# EAGLE design OMHDR (EAGLE 5.12)
VERSION: OMHDR_2_2

## Sheet 1 of 2
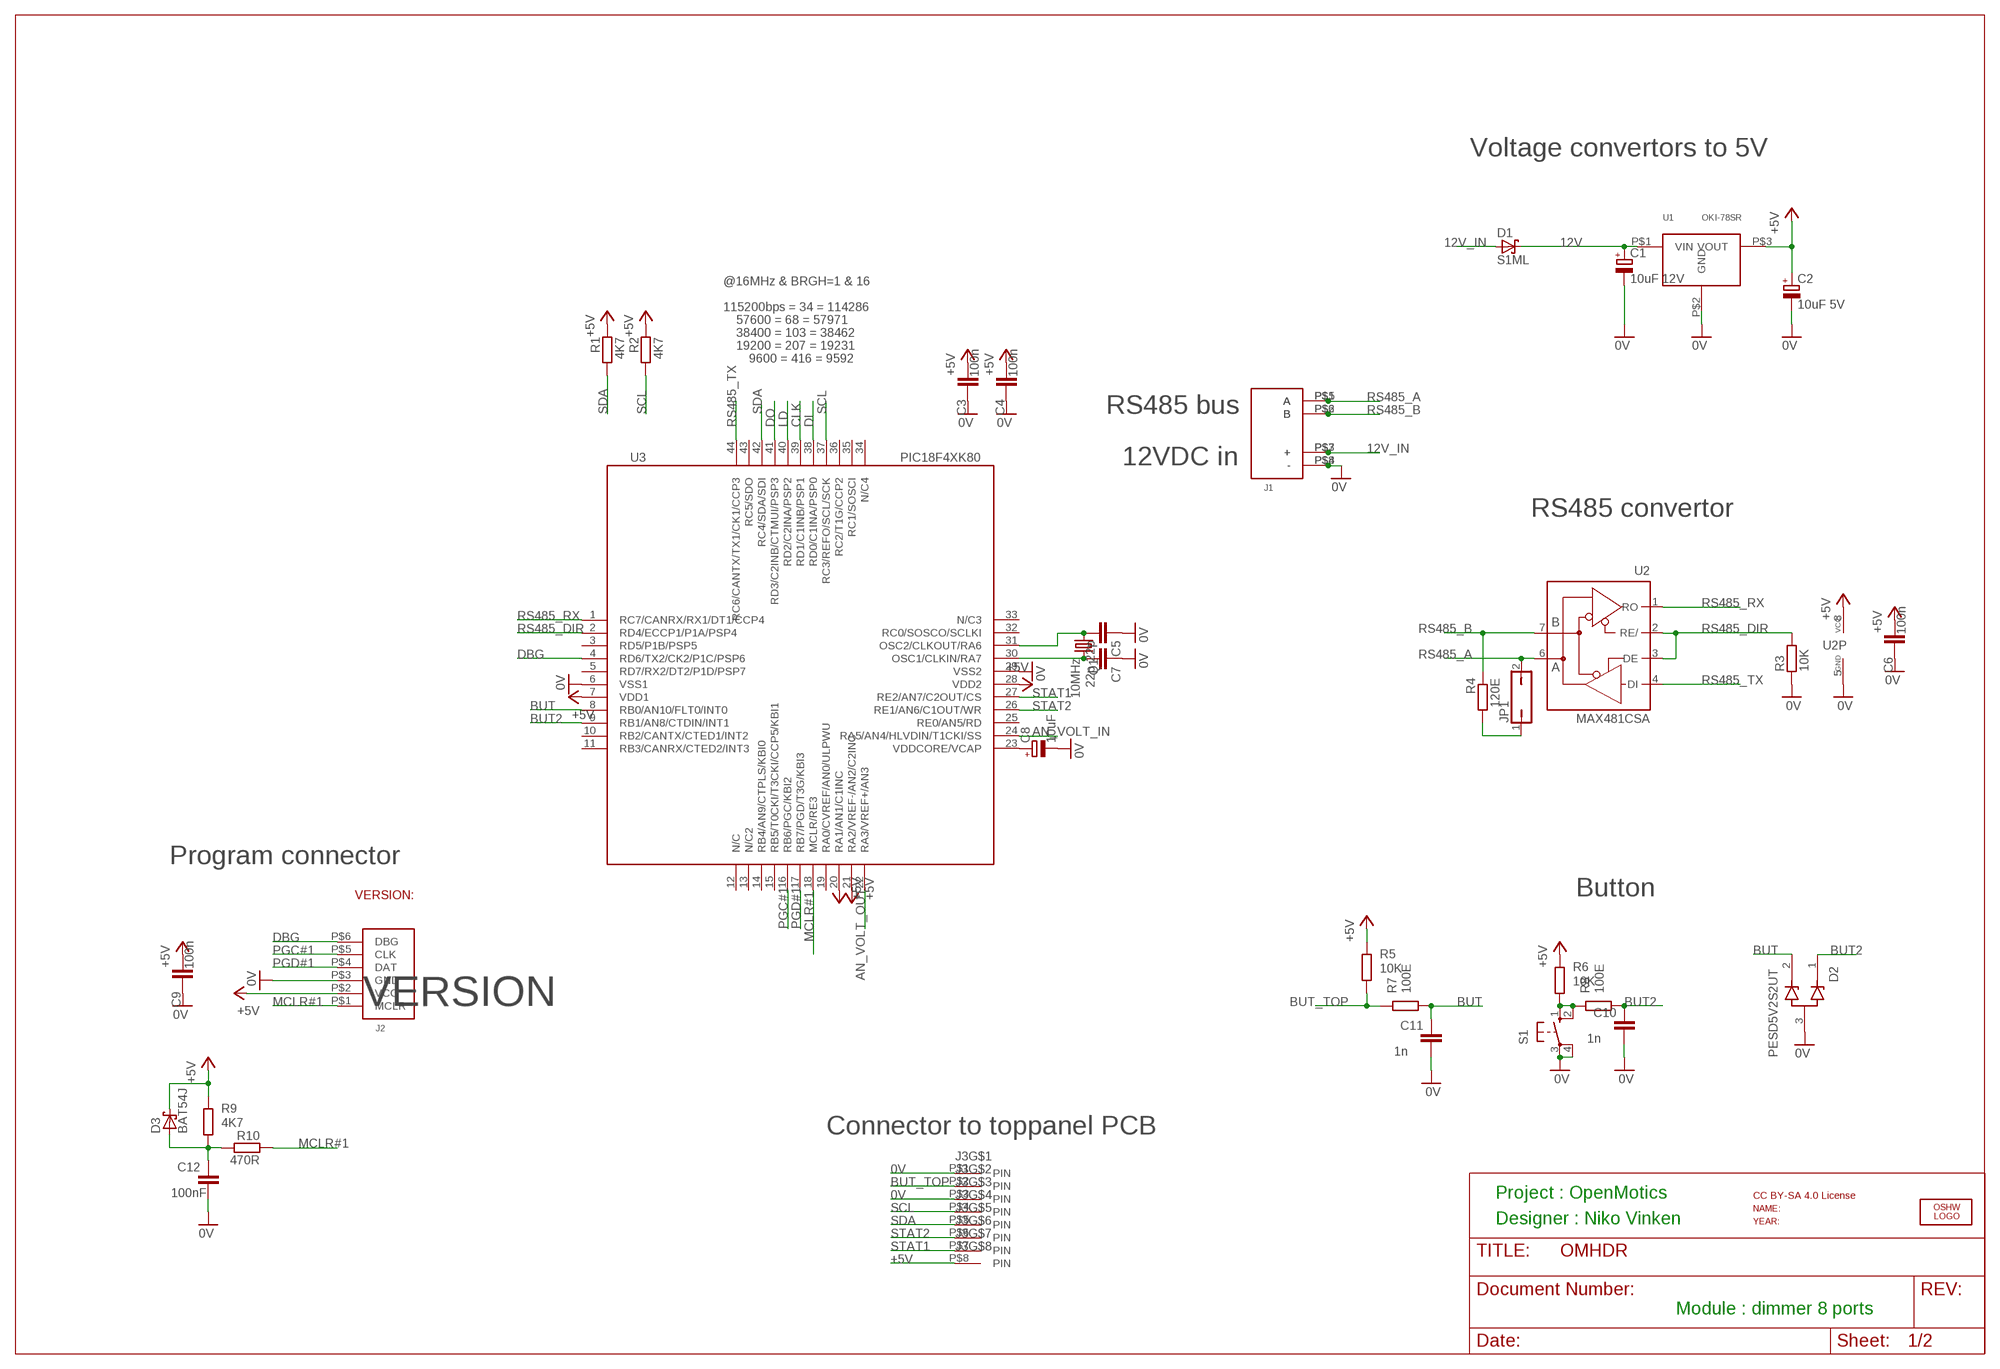
[diagram p0: schematic, sheet 1]

### Parts
C1  10uF 12V  CPOL-EUA3216-18W  [A3216-18W]
C2  10uF 5V  CPOL-EUA3216-18W  [A3216-18W]
C3  100n  C-EUC0603  [C0603]
C4  100n  C-EUC0603  [C0603]
C5  22p  C-EUC0603  [C0603]
C6  100n  C-EUC0603  [C0603]
C7  22p  C-EUC0603  [C0603]
C8  10uF  CPOL-EUA3216-18W  [A3216-18W]
C9  100n  C-EUC0603  [C0603]
C10  1n  C-EUC0603  [C0603]
C11  1n  C-EUC0603  [C0603]
C12  100nF  C-EUC0603  [C0603]
D1  S1ML  SMF5.0AT1  [SOD123FL]
D2  PESD5V2S2UT  PESD3V3S2UAT  [SOT23]
D3  BAT54J  [SOD323_REFLOW]
J1  PTDA_1.5_4-PH_5.0  [PTDA_1.5_X-PH_5.0]
J2  PROG_CON  [PROG_CON_WITH_VERSION]
J3  8PIN_CON_AMP  [8PIN_CON_AMP]
JP1  JP1Q  [JP1S]
LOGO2  OSHW_LOGO_FILLX0150-NT  [OSHW_FILLX150_NOTEXT]
Q1  10MHz  CRYSTALSM49  [SM49]
R1  4K7  R-EU_R0603  [R0603]
R2  4K7  R-EU_R0603  [R0603]
R3  10K  R-EU_R0603  [R0603]
R4  120E  R-EU_R1206  [R1206]
R5  10K  R-EU_R0603  [R0603]
R6  10K  R-EU_R0603  [R0603]
R7  100E  R-EU_R0603  [R0603]
R8  100E  R-EU_R0603  [R0603]
R9  4K7  R-EU_R0603  [R0603]
R10  470R  R-EU_R0603  [R0603]
S1  10-XX  [B3F-10XX]
U1  OKI-78SR  [OKI-78SR]
U2  MAX481CSA  [SO08]
U3  PIC18F4XK80  [TQFP44]
U$5  CC_BY_SA  [CC_BY_SA]

### Nets
0V: C1.- C2.- C3.2 C4.2 C5.1 C6.2 C7.1 C8.- C9.2 C10.1 C11.1 C12.1 D2.3 J1.P$4(-) J2.P$3(GND) J3.P$1 J3.P$3 R3.1 S1.3(P) S1.4(P1) U1.P$2(GND) U2.5(GND) U3.6(VSS1) U3.29(VSS2) ; also sheet 2
12V: C1.+ D1.C U1.P$1(VIN) ; also sheet 2
12V_IN: D1.A J1.P$3(+)
+5V: C2.+ C3.1 C4.1 C6.1 C9.1 D3.1 J2.P$2(VCC) J3.P$8 R1.1 R2.1 R5.2 R6.2 R9.2 U1.P$3(VOUT) U2.8(VCC) U3.7(VDD1) U3.20(RA1/AN1/C1INC) U3.21(RA2/VREF-/AN2/C2INC) U3.28(VDD2) ; also sheet 2
AN_VOLT_IN: U3.24(RA5/AN4/HLVDIN/T1CKI/SS) ; also sheet 2
AN_VOLT_OUT: U3.22(RA3/VREF+/AN3) ; also sheet 2
BUT: C11.2 D2.2 R7.1 U3.8(RB0/AN10/FLT0/INT0)
BUT1: R6.1 R8.2 S1.1(S) S1.2(S1)
BUT2: C10.2 D2.1 R8.1 U3.9(RB1/AN8/CTDIN/INT1)
BUT_TOP: J3.P$2 R5.1 R7.2
CLK: U3.39(RD1/C1INB/PSP1) ; also sheet 2
DBG: J2.P$6(DBG) U3.4(RD6/TX2/CK2/P1C/PSP6)
DI: U3.38(RD0/C1INA/PSP0) ; also sheet 2
DO: U3.41(RD3/C2INB/CTMUI/PSP3) ; also sheet 2
LD: U3.40(RD2/C2INA/PSP2) ; also sheet 2
MCLR#1: J2.P$1(MCLR) R10.1 U3.18(MCLR/RE3)
N$1: JP1.1 R4.2
N$9: C12.2 D3.2 R9.1 R10.2
N$32: C7.2 Q1.2 U3.30(OSC1/CLKIN/RA7)
N$33: C8.+ U3.23(VDDCORE/VCAP)
PGC#1: J2.P$5(CLK) U3.16(RB6/PGC/KBI2)
PGD#1: J2.P$4(DAT) U3.17(RB7/PGD/T3G/KBI3)
RS485_A: J1.P$1(A) JP1.2 U2.6(A)
RS485_B: J1.P$2(B) R4.1 U2.7(B)
RS485_DIR: R3.2 U2.2(RE/) U2.3(DE) U3.2(RD4/ECCP1/P1A/PSP4)
RS485_RX: U2.1(RO) U3.1(RC7/CANRX/RX1/DT1/CCP4)
RS485_TX: U2.4(DI) U3.44(RC6/CANTX/TX1/CK1/CCP3)
SCL: J3.P$4 R2.2 U3.37(RC3/REFO/SCL/SCK)
SDA: J3.P$5 R1.2 U3.42(RC4/SDA/SDI)
STAT1: J3.P$7 U3.27(RE2/AN7/C2OUT/CS)
STAT2: J3.P$6 U3.26(RE1/AN6/C1OUT/WR)
Y1: C5.2 Q1.1 U3.31(OSC2/CLKOUT/RA6)
Unconnected: J1.P$5(A) J1.P$6(B) J1.P$7(+) J1.P$8(-) U3.3(RD5/P1B/PSP5) U3.5(RD7/RX2/DT2/P1D/PSP7) U3.10(RB2/CANTX/CTED1/INT2) U3.11(RB3/CANRX/CTED2/INT3) U3.12(N/C) U3.13(N/C2) U3.14(RB4/AN9/CTPLS/KBI0) U3.15(RB5/T0CKI/T3CKI/CCP5/KBI1) U3.19(RA0/CVREF/AN0/ULPWU) U3.25(RE0/AN5/RD) U3.32(RC0/SOSCO/SCLKI) U3.33(N/C3) U3.34(N/C4) U3.35(RC1/SOSCI) U3.36(RC2/T1G/CCP2) U3.43(RC5/SDO)

### Notes on the sheet
- Voltage convertors to 5V
- @16MHz & BRGH=1 & 16
- 115200bps = 34 = 114286
- 57600 = 68 = 57971
- 38400 = 103 = 38462
- 19200 = 207 = 19231
- 9600 = 416 = 9592
- RS485 bus
- 12VDC in
- RS485 convertor
- Program connector
- Button
- Connector to toppanel PCB
- Project : OpenMotics
- Designer : Niko Vinken
- Module : dimmer 8 ports

## Sheet 2 of 2
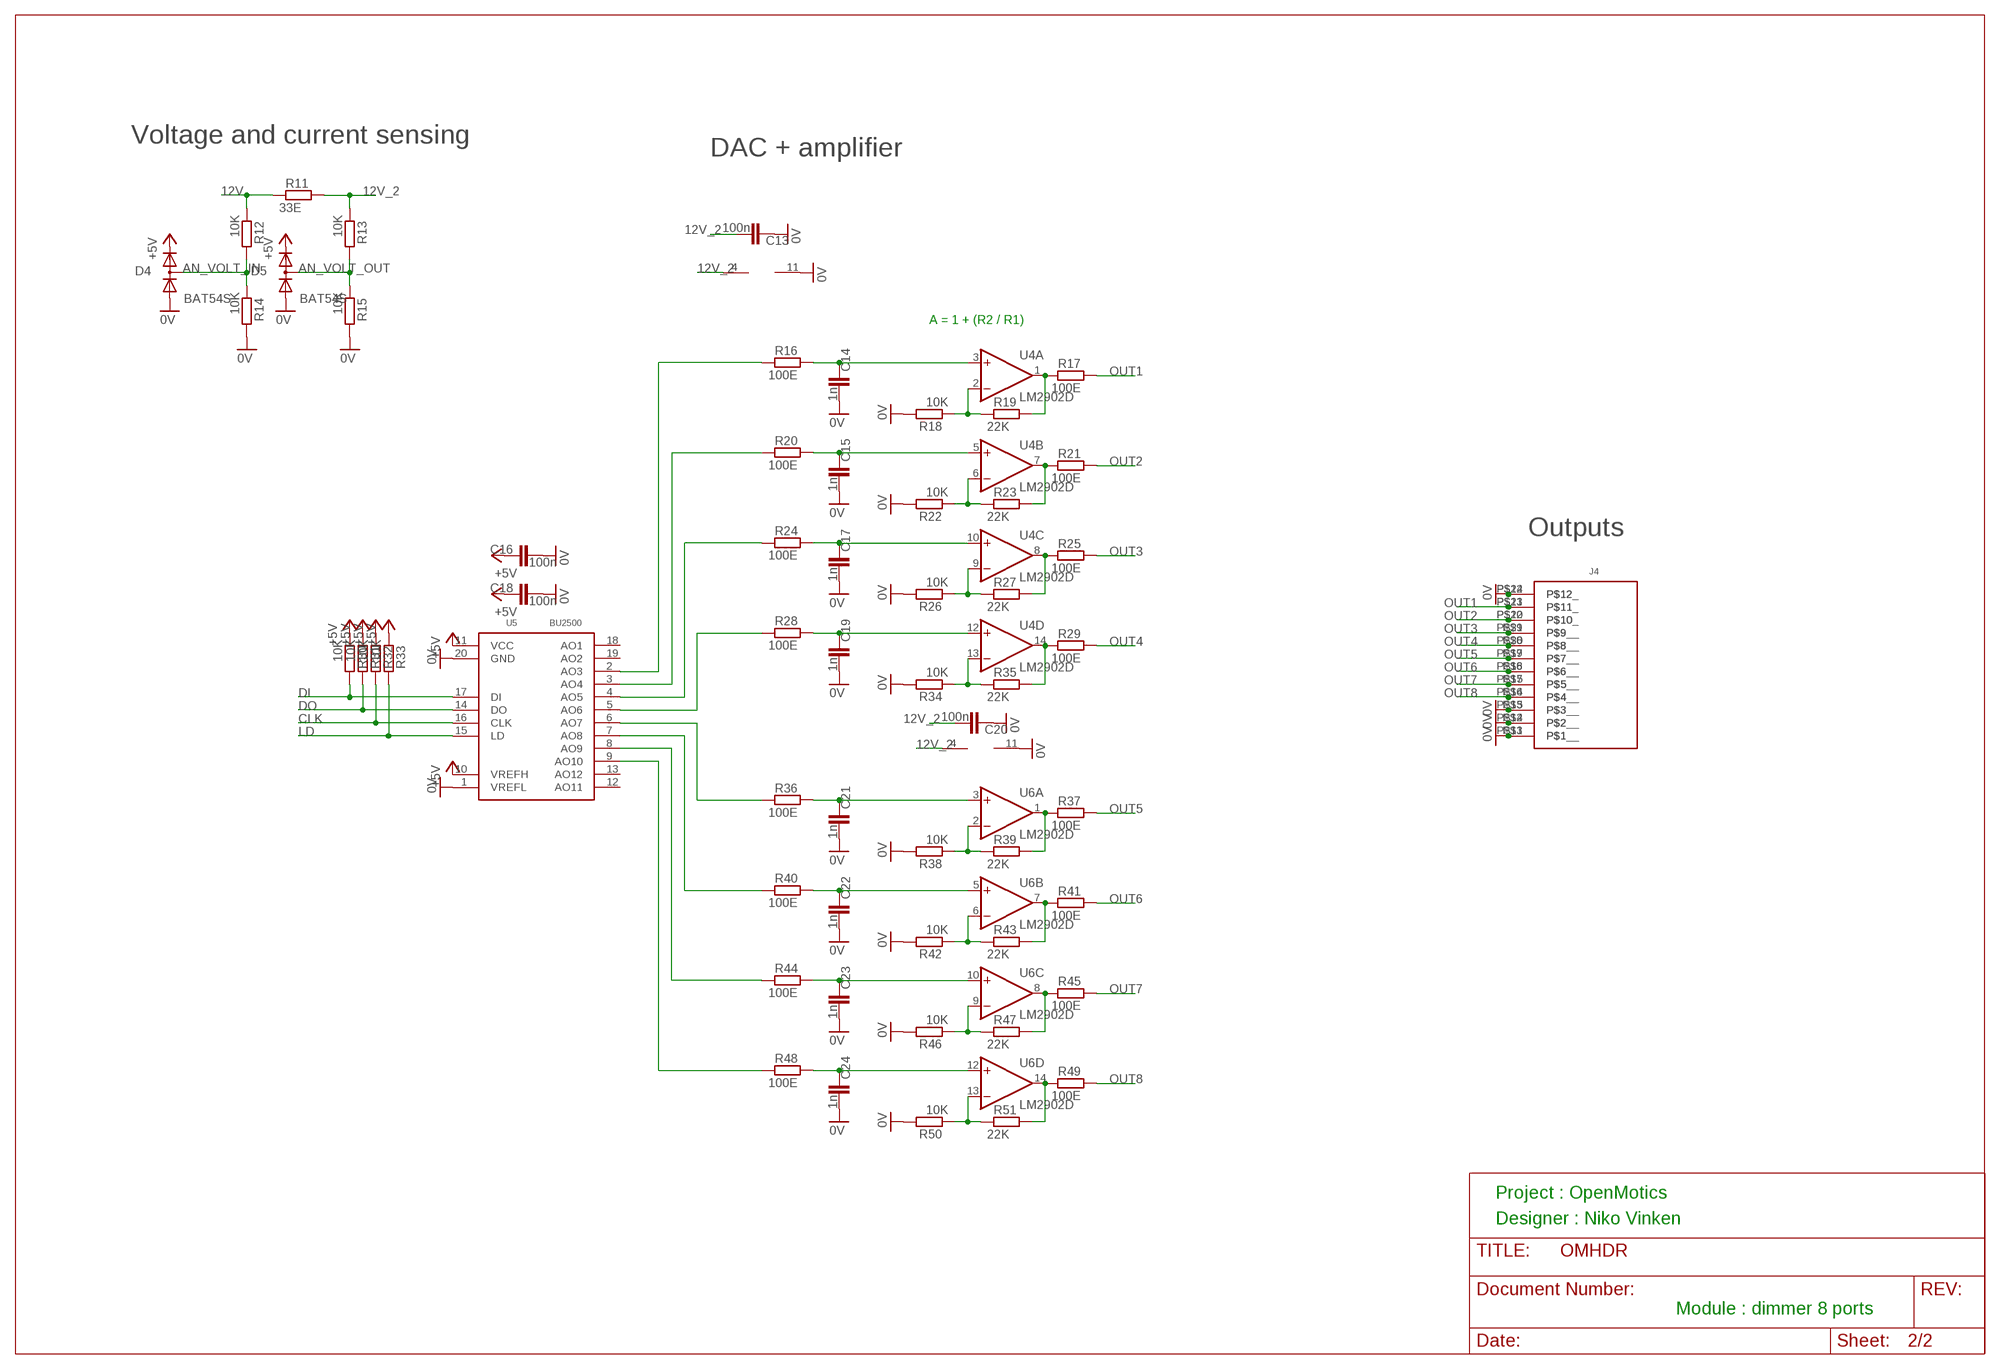
[diagram p1: schematic, sheet 2]

### Parts
C13  100n  C-EUC0603  [C0603]
C14  1n  C-EUC0603  [C0603]
C15  1n  C-EUC0603  [C0603]
C16  100n  C-EUC0603  [C0603]
C17  1n  C-EUC0603  [C0603]
C18  100n  C-EUC0603  [C0603]
C19  1n  C-EUC0603  [C0603]
C20  100n  C-EUC0603  [C0603]
C21  1n  C-EUC0603  [C0603]
C22  1n  C-EUC0603  [C0603]
C23  1n  C-EUC0603  [C0603]
C24  1n  C-EUC0603  [C0603]
D4  BAT54S  BAV199  [SOT23]
D5  BAT54S  BAV199  [SOT23]
J4  PTDA_1.5_12-PH_3.5  [PTDA_1.5_X-PH_3.5]
R11  33E  R-EU_R1206  [R1206]
R12  10K  R-EU_R0603  [R0603]
R13  10K  R-EU_R0603  [R0603]
R14  10K  R-EU_R0603  [R0603]
R15  10K  R-EU_R0603  [R0603]
R16  100E  R-EU_R0603  [R0603]
R17  100E  R-EU_R0603  [R0603]
R18  10K  R-EU_R0603  [R0603]
R19  22K  R-EU_R0603  [R0603]
R20  100E  R-EU_R0603  [R0603]
R21  100E  R-EU_R0603  [R0603]
R22  10K  R-EU_R0603  [R0603]
R23  22K  R-EU_R0603  [R0603]
R24  100E  R-EU_R0603  [R0603]
R25  100E  R-EU_R0603  [R0603]
R26  10K  R-EU_R0603  [R0603]
R27  22K  R-EU_R0603  [R0603]
R28  100E  R-EU_R0603  [R0603]
R29  100E  R-EU_R0603  [R0603]
R30  10K  R-EU_R0603  [R0603]
R31  10K  R-EU_R0603  [R0603]
R32  10K  R-EU_R0603  [R0603]
R33  10K  R-EU_R0603  [R0603]
R34  10K  R-EU_R0603  [R0603]
R35  22K  R-EU_R0603  [R0603]
R36  100E  R-EU_R0603  [R0603]
R37  100E  R-EU_R0603  [R0603]
R38  10K  R-EU_R0603  [R0603]
R39  22K  R-EU_R0603  [R0603]
R40  100E  R-EU_R0603  [R0603]
R41  100E  R-EU_R0603  [R0603]
R42  10K  R-EU_R0603  [R0603]
R43  22K  R-EU_R0603  [R0603]
R44  100E  R-EU_R0603  [R0603]
R45  100E  R-EU_R0603  [R0603]
R46  10K  R-EU_R0603  [R0603]
R47  22K  R-EU_R0603  [R0603]
R48  100E  R-EU_R0603  [R0603]
R49  100E  R-EU_R0603  [R0603]
R50  10K  R-EU_R0603  [R0603]
R51  22K  R-EU_R0603  [R0603]
U4  LM2902D  [SO14]
U5  BU2500  [SSOP20]
U6  LM2902D  [SO14]
U$4  CNMB/3  [CNMB/3-]  (not placed on a sheet)

### Nets
0V: C13.2 C14.1 C15.1 C16.1 C17.1 C18.1 C19.1 C20.2 C21.1 C22.1 C23.1 C24.1 D4.1(A) D5.1(A) J4.P$1 J4.P$2 J4.P$3 J4.P$12 J4.P$13(P$1__) J4.P$14(P$2__) J4.P$15(P$3__) J4.P$24(P$12_) R14.2 R15.2 R18.2 R22.2 R26.2 R34.2 R38.2 R42.2 R46.2 R50.2 U4.11(P:V-) U5.1(VREFL) U5.20(GND) U6.11(P:V-) ; also sheet 1
12V: R11.1 R12.1 ; also sheet 1
12V_2: C13.1 C20.1 R11.2 R13.1 U4.4(P:V+) U6.4(P:V+)
+5V: C16.2 C18.2 D4.2(C) D5.2(C) R30.1 R31.1 R32.1 R33.1 U5.10(VREFH) U5.11(VCC) ; also sheet 1
AN_VOLT_IN: D4.3(AC) R12.2 R14.1 ; also sheet 1
AN_VOLT_OUT: D5.3(AC) R13.2 R15.1 ; also sheet 1
CLK: R32.2 U5.16(CLK) ; also sheet 1
DI: R30.2 U5.17(DI) ; also sheet 1
DO: R31.2 U5.14(DO) ; also sheet 1
LD: R33.2 U5.15(LD) ; also sheet 1
N$2: R16.1 U5.2(AO3)
N$6: C14.2 R16.2 U4.3(A:+IN)
N$7: R28.1 U5.5(AO6)
N$8: R24.1 U5.4(AO5)
N$11: R38.1 R39.1 U6.2(A:-IN)
N$12: R42.1 R43.1 U6.6(B:-IN)
N$13: R46.1 R47.1 U6.9(C:-IN)
N$14: R50.1 R51.1 U6.13(D:-IN)
N$15: R37.1 R39.2 U6.1(A:OUT)
N$16: R41.1 R43.2 U6.7(B:OUT)
N$17: R45.1 R47.2 U6.8(C:OUT)
N$18: R49.1 R51.2 U6.14(D:OUT)
N$19: R36.1 U5.6(AO7)
N$20: R18.1 R19.1 U4.2(A:-IN)
N$21: R22.1 R23.1 U4.6(B:-IN)
N$22: R26.1 R27.1 U4.9(C:-IN)
N$23: R34.1 R35.1 U4.13(D:-IN)
N$24: R17.1 R19.2 U4.1(A:OUT)
N$25: R21.1 R23.2 U4.7(B:OUT)
N$26: R25.1 R27.2 U4.8(C:OUT)
N$27: R29.1 R35.2 U4.14(D:OUT)
N$28: R40.1 U5.7(AO8)
N$29: R48.1 U5.9(AO10)
N$30: C15.2 R20.2 U4.5(B:+IN)
N$31: R20.1 U5.3(AO4)
N$34: R44.1 U5.8(AO9)
N$35: C17.2 R24.2 U4.10(C:+IN)
N$36: C19.2 R28.2 U4.12(D:+IN)
N$37: C21.2 R36.2 U6.3(A:+IN)
N$38: C22.2 R40.2 U6.5(B:+IN)
N$39: C23.2 R44.2 U6.10(C:+IN)
N$40: C24.2 R48.2 U6.12(D:+IN)
OUT1: J4.P$11 J4.P$23(P$11_) R17.2
OUT2: J4.P$10 J4.P$22(P$10_) R21.2
OUT3: J4.P$9 J4.P$21(P$9__) R25.2
OUT4: J4.P$8 J4.P$20(P$8__) R29.2
OUT5: J4.P$7 J4.P$19(P$7__) R37.2
OUT6: J4.P$6 J4.P$18(P$6__) R41.2
OUT7: J4.P$5 J4.P$17(P$5__) R45.2
OUT8: J4.P$4 J4.P$16(P$4__) R49.2
Unconnected: U5.12(AO11) U5.13(AO12) U5.18(AO1) U5.19(AO2)

### Notes on the sheet
- Voltage and current sensing
- DAC + amplifier
- A = 1 + (R2 / R1)
- Outputs
- Project : OpenMotics
- Designer : Niko Vinken
- Module : dimmer 8 ports

## Library data of the parts
C1 C2 C8 = resistor:CPOL-EU: POLARIZED CAPACITOR, European symbol
C3-C7 C9-C24 = resistor:C-EU: CAPACITOR, European symbol
D1 = diode:SMF5.0AT1: 200 W Transient Voltage Suppressor Source: Data sheet <http://www.onsemi.com/pub_link/Collateral/SMF5.0AT1-D.PDF>
D2 = OpenMotics:PESD3V3S2UAT
D3 = OpenMotics:BAT54J
D4 D5 = diode:BAV199: DIODE low-leakage double diode
J1 = OpenMotics:PTDA_1.5_4-PH_5.0
J2 = OpenMotics:PROG_CON
J3 = OpenMotics:8PIN_CON_AMP
J4 = OpenMotics:PTDA_1.5_12-PH_3.5
JP1 = jumper:JP1Q: JUMPER
LOGO2 = ohw-logo:OSHW_LOGO_FILL
Q1 = crystal:CRYSTAL: CRYSTAL
R1-R10 = resistor:R-EU_: RESISTOR, European symbol
R11-R51 = rcl:R-EU_: RESISTOR, European symbol
S1 = switch-omron:10-XX: OMRON SWITCH; MPN: B3F-1000; OC_FARNELL: 176432; OC_NEWARK: 36M3542
U1 = OpenMotics:OKI-78SR
U2 = maxim:MAX481CSA: RS485 TRANSEIVER
U3 = OpenMotics:PIC18F4XK80
U4 U6 = linear:LM2902: COMPARATOR
U5 = OpenMotics:BU2500
U$4 = OpenMotics:CNMB/3
U$5 = OpenMotics:CC_BY_SA

## Board
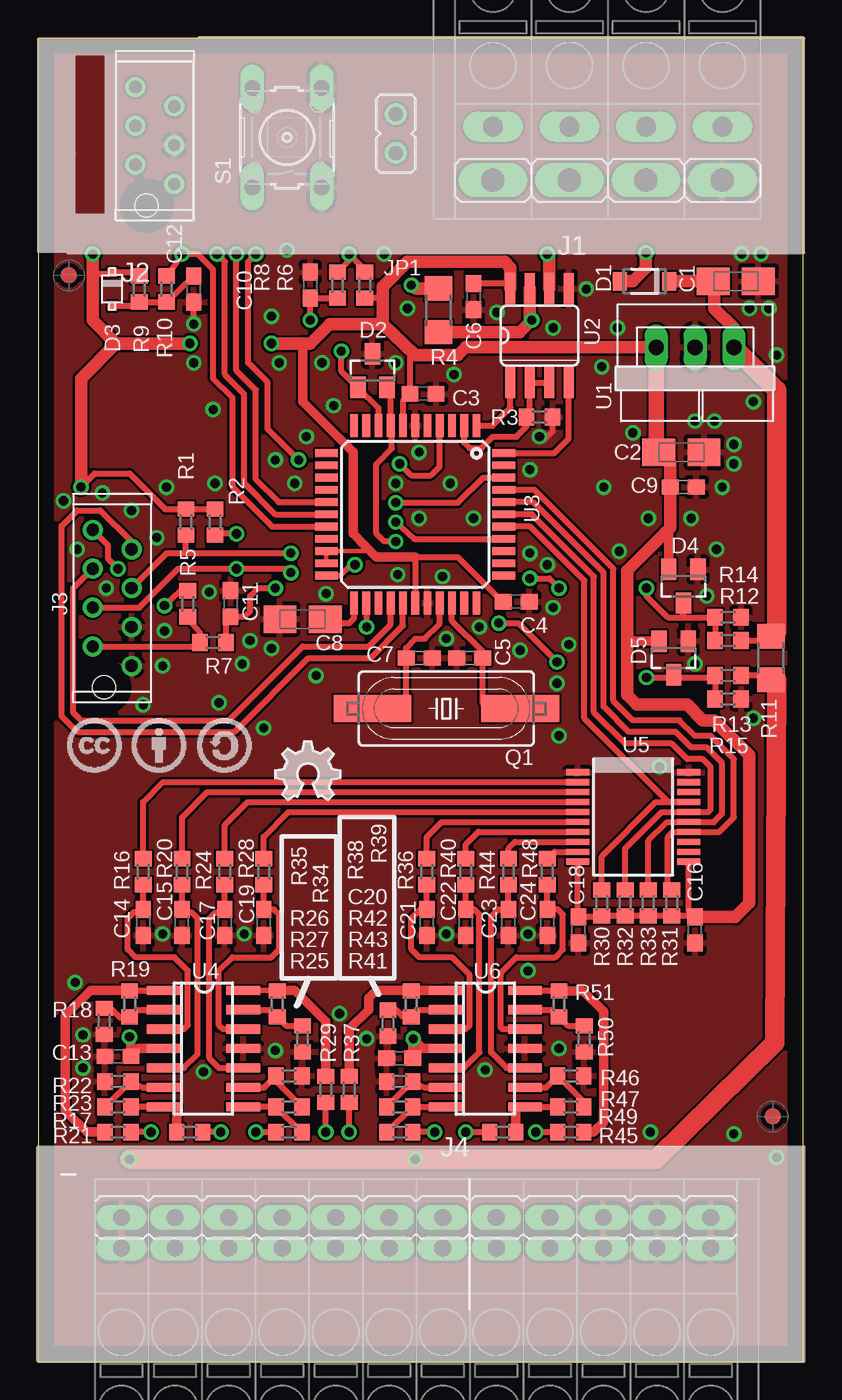
[diagram p2: board, top side]
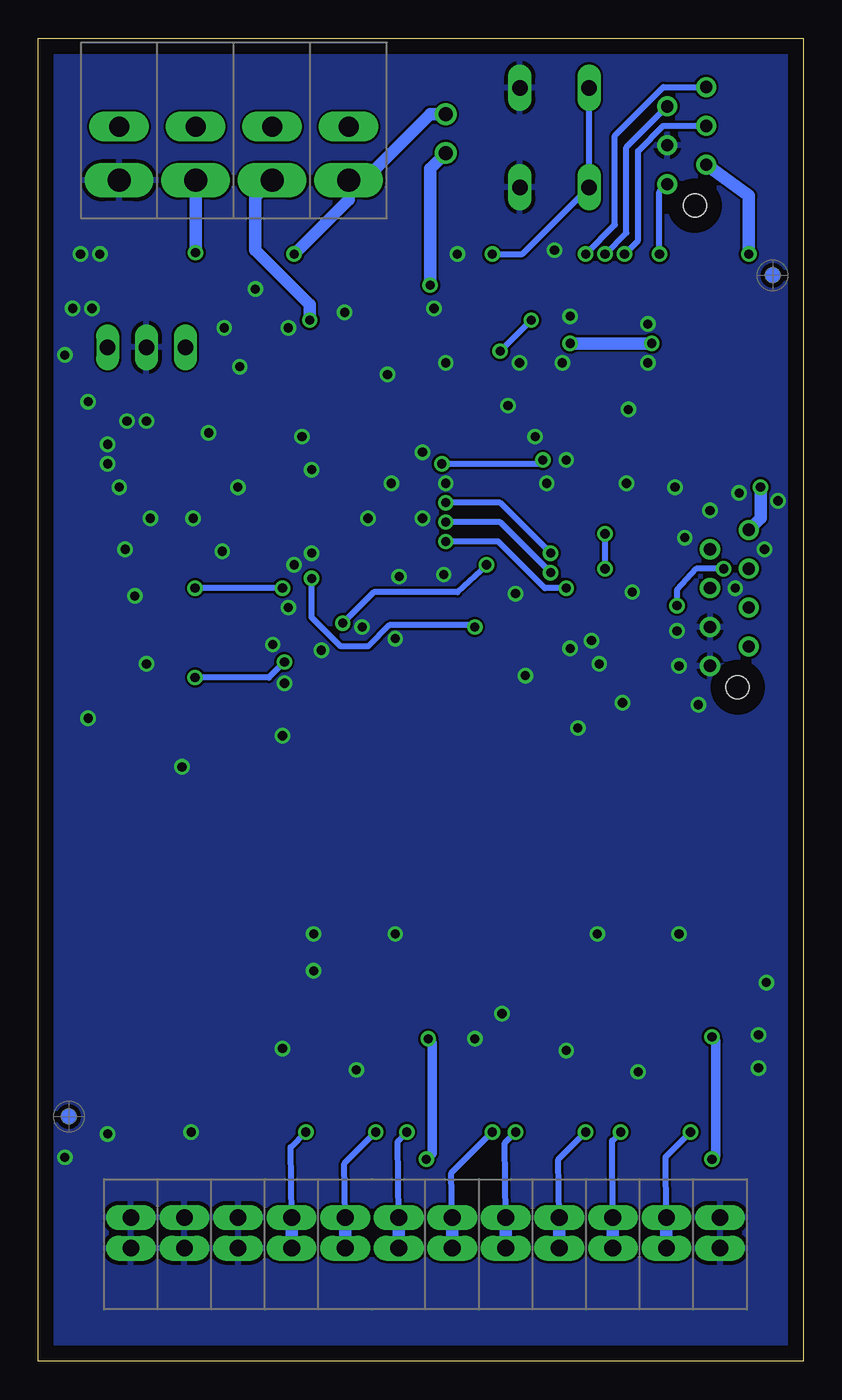
[diagram p3: board, bottom side, seen from below]

Size 50 x 86.5 mm. Coordinates in mm from the lower left corner, seen from the top.
Outline: 0,0 50,0 50,86.5 0,86.5 0,0
Copper layers (1+16): Top 0.035mm / dielectric 1.5mm / Bottom 0.035mm
Design rules "default *": minimum track width 10mil, minimum drill 24mil, track to track 6mil, track to pad 6mil, pad to pad 6mil, via to via 6mil, smd to smd 6mil, copper to edge 40mil, drill to drill 8mil, minimum pad ring 10mil, minimum via ring 8mil, stop-mask expansion 4mil, vias tented up to drill 0mil, thermal gap 10mil

### Footprints (pad centres in the part's own frame; a part is rotated, then mirrored left to right if it is on the bottom)
A3216-18W = smd 2.15 x 1.8: + 1.475,0; - -1.475,0
C0603 = smd 1.1 x 1: 1 -0.85,0; 2 0.85,0
SOD123FL = smd 0.91 x 1.22: A 1.625,0; C -1.625,0
SOT23 = smd 1 x 1.4: 1 -0.95,-1.1; 2 0.95,-1.1; 3 0,1.1
SOD323_REFLOW = smd 0.6 x 0.6: 1 1.1,0; 2 -1.1,0
PTDA_1.5_X-PH_5.0 = drill 1.5 long: P$1 0,0; P$2 5,0; P$3 10,0; P$4 15,0 | drill 1.3 long: P$5 0,3.5; P$6 5,3.5; P$7 10,3.5; P$8 15,3.5
PROG_CON_WITH_VERSION = drill 0.8 round: P$1 0,0; P$2 -2.54,1.27; P$3 0,2.54; P$4 -2.54,3.81; P$5 0,5.08; P$6 -2.54,6.35 | hole 1.5: -1.8,-1.4
8PIN_CON_AMP = drill 0.8 round: P$1 0,0; P$2 1.27,2.54; P$3 2.54,0; P$4 3.81,2.54; P$5 5.08,0; P$6 6.35,2.54; P$7 7.62,0; P$8 8.89,2.54 | hole 1.5: -1.4,1.8
PTDA_1.5_X-PH_3.5 = drill 1.1 pad 1.422 long: P$1 0,0; P$2 3.5,0; P$3 7,0; P$4 10.5,0; P$5 14,0; P$6 17.5,0; P$7 21,0; P$8 24.5,0; P$9 28,0; P$10 31.5,0; P$11 35,0; P$12 38.5,0; P$13 0,2; P$14 3.5,2; P$15 7,2; P$16 10.5,2; P$17 14,2; P$18 17.5,2; P$19 21,2; P$20 24.5,2; P$21 28,2; P$22 31.5,2; P$23 35,2; P$24 38.5,2
JP1S = drill 0.914 round: 1 1.27,1.27; 2 1.27,3.81
SM49 = smd 5.08 x 1.778: 1 -4.826,0; 2 4.826,0
R0603 = smd 1 x 1.1: 1 -0.85,0; 2 0.85,0
R1206 = smd 1.6 x 1.803: 1 -1.422,0; 2 1.422,0
B3F-10XX = drill 1.016 long: 1 -3.251,2.261; 2 3.251,2.261; 3 -3.251,-2.261; 4 3.251,-2.261
OKI-78SR = drill 1 long: P$1 0,0; P$2 2.54,0; P$3 5.08,0
SO08 = smd 0.66 x 2.032: 1 -1.905,-3.073; 2 -0.635,-3.073; 3 0.635,-3.073; 4 1.905,-3.073; 5 1.905,3.073; 6 0.635,3.073; 7 -0.635,3.073; 8 -1.905,3.073
TQFP44 = smd 1.5 x 0.5: 1 -5.8,4; 2 -5.8,3.2; 3 -5.8,2.4; 4 -5.8,1.6; 5 -5.8,0.8; 6 -5.8,0; 7 -5.8,-0.8; 8 -5.8,-1.6; 9 -5.8,-2.4; 10 -5.8,-3.2; 11 -5.8,-4; 23 5.8,-4; 24 5.8,-3.2; 25 5.8,-2.4; 26 5.8,-1.6; 27 5.8,-0.8; 28 5.8,0; 29 5.8,0.8; 30 5.8,1.6; 31 5.8,2.4; 32 5.8,3.2; 33 5.8,4 | smd 0.5 x 1.5: 12 -4,-5.8; 13 -3.2,-5.8; 14 -2.4,-5.8; 15 -1.6,-5.8; 16 -0.8,-5.8; 17 0,-5.8; 18 0.8,-5.8; 19 1.6,-5.8; 20 2.4,-5.8; 21 3.2,-5.8; 22 4,-5.8; 34 4,5.8; 35 3.2,5.8; 36 2.4,5.8; 37 1.6,5.8; 38 0.8,5.8; 39 0,5.8; 40 -0.8,5.8; 41 -1.6,5.8; 42 -2.4,5.8; 43 -3.2,5.8; 44 -4,5.8
SO14 = smd 0.6 x 2.2: 1 -3.81,-2.6; 2 -2.54,-2.6; 3 -1.27,-2.6; 4 0,-2.6; 5 1.27,-2.6; 6 2.54,-2.6; 7 3.81,-2.6; 8 3.81,2.6; 9 2.54,2.6; 10 1.27,2.6; 11 0,2.6; 12 -1.27,2.6; 13 -2.54,2.6; 14 -3.81,2.6
SSOP20 = smd 0.4 x 1.5: 1 -2.925,-3.625; 2 -2.275,-3.625; 3 -1.625,-3.625; 4 -0.975,-3.625; 5 -0.325,-3.625; 6 0.325,-3.625; 7 0.975,-3.625; 8 1.625,-3.625; 9 2.275,-3.625; 10 2.925,-3.625; 11 2.925,3.625; 12 2.275,3.625; 13 1.625,3.625; 14 0.975,3.625; 15 0.325,3.625; 16 -0.325,3.625; 17 -0.975,3.625; 18 -1.625,3.625; 19 -2.275,3.625; 20 -2.925,3.625

### Placement (x,y rotation side)
C1  45.59,70.61 180 top
C2  42.04,59.44 180 top
C3  25.15,63.25 0 top
C4  31.24,49.66 0 top
C5  28.19,45.97 0 top
C6  28.45,69.6 270 top
C7  24.89,45.97 180 top
C8  17.27,48.51 0 top
C9  42.16,57.15 0 top
C10  17.78,70.36 270 top
C11  12.57,49.53 270 top
C12  10.16,70.1 90 top
C13  5.21,19.94 180 top
C14  6.86,28.7 90 top
C15  9.4,28.7 90 top
C16  42.93,28.19 90 top
C17  12.19,28.7 90 top
C18  35.31,28.19 90 top
C19  14.73,28.7 90 top
C20  23.62,19.81 180 top
C21  25.4,28.7 90 top
C22  27.94,28.7 90 top
C23  30.73,28.7 90 top
C24  33.27,28.7 90 top
D1  39.62,70.61 180 top
D2  21.84,64.77 0 top
D3  4.83,70.1 90 top
D4  42.16,50.67 180 top
D5  41.53,45.97 180 top
J1  29.72,77.22 0 top
J2  8.89,76.96 0 top
J3  6.1,45.47 90 top
J4  43.94,9.4 180 top
JP1  22.1,77.72 0 top
LOGO2  15.49,36.7 0 top
Q1  26.67,42.67 180 top
R1  9.65,54.86 270 top
R2  11.56,54.86 270 top
R3  32.77,61.72 180 top
R4  26.16,68.71 90 top
R5  9.78,49.53 90 top
R6  21.34,70.36 270 top
R7  11.43,46.99 180 top
R8  19.56,70.36 90 top
R9  6.6,70.1 90 top
R10  8.38,70.1 270 top
R11  47.88,45.97 270 top
R12  45.09,47.12 180 top
R13  45.09,44.83 180 top
R14  45.09,48.64 0 top
R15  45.09,43.31 0 top
R16  6.86,32 270 top
R17  5.21,14.99 0 top
R18  4.32,22.23 270 top
R19  5.97,23.37 90 top
R20  9.4,32 270 top
R21  9.91,14.99 0 top
R22  5.21,18.29 180 top
R23  5.21,16.64 0 top
R24  12.19,32 270 top
R25  16.38,14.99 180 top
R26  16.38,18.67 0 top
R27  16.38,16.64 180 top
R28  14.73,32 270 top
R29  18.8,17.78 270 top
R30  36.83,29.97 90 top
R31  41.4,29.97 90 top
R32  38.35,29.97 90 top
R33  39.88,29.97 90 top
R34  17.27,21.08 270 top
R35  15.62,23.37 90 top
R36  25.4,32 270 top
R37  20.32,17.78 270 top
R38  22.86,22.1 270 top
R39  24.38,23.37 90 top
R40  27.94,32 270 top
R41  23.62,14.99 0 top
R42  23.62,18.29 180 top
R43  23.62,16.64 0 top
R44  30.73,32 270 top
R45  30.35,14.99 180 top
R46  34.8,18.67 0 top
R47  34.8,16.64 180 top
R48  33.27,32 270 top
R49  34.8,14.99 180 top
R50  35.69,21.08 270 top
R51  34.04,23.37 90 top
S1  16.26,80.01 90 top
U1  45.47,66.29 180 top
U2  32.77,67.06 0 top
U3  24.64,55.37 270 top
U4  10.79,20.45 270 top
U5  38.88,35.59 270 top
U6  29.21,20.45 270 top
U$1  [FIDUCIAL_G10]  48,16 0 bottom
U$2  [FIDUCIAL_G10]  2,71 0 top
U$3  [FIDUCIAL_G10]  48,16 0 top
U$4  -1.52,-1.78 0 top
U$5  7.87,40.26 0 top
U$12  [FIDUCIAL_G10]  2,71 0 bottom

### Tracks (layer width: path | path; a pad name or v marks a point on that pad's centre or on a via)
0V  (via drill 0.6)
  Top 0.406: R3.1 33.62,60.79 33.02,60.2 | v10.16,67.82 C12.1
  other vias: 16.26,72.64 24.13,68.83 29.97,68.58 35.81,70.1 45.47,59.94 44.2,61.47 42.93,61.47 45.47,58.67 44.7,57.15 24.89,59.44 26.42,51.31 26.67,47.24 13.84,47.12 15.24,46.61 26.92,57.4 24.89,55.12 28.45,55.12 27.18,64.52 23.37,65.28 15.75,65.28 16.76,57.4 8.38,57.15 6.1,55.63 4.45,50.55 8.26,47.75 8.13,45.47 17.53,60.45 6.86,42.93 32.77,60.45 18.54,65.28 19.3,62.48 22.61,72.39 47.24,72.39 23.37,57.4 2.92,21.34 2.92,19.18 15.49,20.32 34.04,20.45 48.26,13.34 45.47,14.86 40.01,14.99 29.21,19.05 10.79,18.92 2.41,24.77 32,25.53 19.68,22.73 40.61,38.86 34.04,40.89 32.13,58.29 32.13,52.83 33.66,49.28 44.32,53.09 42.93,45.59 46.74,42.04 43.69,50.04 33.91,44.32 34.67,46.86 33.27,52.07 37.97,52.96 36.96,57.15 38.86,60.71 33.66,67.56 21.46,21.08 28.83,48.01 31.5,46.48 11.18,50.29 2.54,53.09 4.19,56.77 7.75,53.85 13.34,45.59 11.81,43.05 18.16,44.83 14.73,41.4 23.5,51.44 18.81,50.19 1.65,56.26 15.24,68.33 10.16,65.28 15.49,58.93 11.43,62.23 11.56,57.4 8.13,27.94 13.46,27.94 32,27.94 26.67,27.94 45.97,72.39 46.48,68.83 47.75,68.83 48.26,65.79 46.74,62.74 36.83,65.02 37.85,67.56 42.67,55.12 39.88,55.12
  pour Bottom: 0.25,86.36 49.78,86.36 49.78,0.25 0.25,0.25
  pour Top: 0.25,86.36 49.78,86.36 49.78,0.25 0.25,0.25
12V
  Top 0.406: R12.1 47.6,47.12 R11.1
  Top 0.813: D1.C C1.+ 44.2,70.53 44.2,68.83 45.47,67.56 U1.P$1
  Top 1.27: R11.1 arc90 48.26,47.78 48.26,63.5 U1.P$1
12V_2  (via drill 0.6)
  Top 0.406: R13.1 47.6,44.83 R11.2
  Top 0.61: U4.4 6.57,20.45 C13.1 6.06,21.12 v5.97,21.21 | U6.4 25.15,20.45 v24.51,21.08 24.47,21.04 C20.1
  Top 1.27: R11.2 48.26,44.55 48.13,20.83 40.39,13.21 v24.64,13.21 v5.97,13.21
  Bottom 0.61: v24.51,21.08 24.26,20.83 24.26,13.59 v24.64,13.21 | v5.97,13.21 5.71,13.46 5.71,20.95 v5.97,21.21
12V_IN  (via drill 0.6)
  Top 0.813: v39.72,72.48 39.72,71.47 38.86,70.61 D1.A
  Bottom 0.813: v39.72,72.48 J1.P$3
+5V  (via drill 0.6)
  Top 0.305: U3.21 U3.20 21.34,52.97 21.34,53.34
  Top 0.406: C6.1 30.54,70.45 U2.8 | R6.2 22.18,69.51 22.52,69.85 | C4.1 30.14,49.87 27.43,52.58 24.64,52.58 U3.28 | U3.7 23.84,62.79 C3.1 24.3,65.62 24.64,65.79 | J3.P$8 4.57,53.34 4.57,52.45 v5.21,51.82 | v8.26,49.4 9.31,50.38 R5.2 | R9.2 6.35,71.2 D3.1 4.74,71.12 3.56,71.12 | U5.10 35.26,29.09 C18.2 36.75,29.04 R30.1 R32.1 R33.1 R31.1 42.85,29.12 C16.2 42.51,29.46 U5.11 | R2.1 R1.1 8.29,55.71 5.97,58.04 3.68,58.04 v2.79,57.15
  Top 0.61: 24.64,52.58 22.1,52.58 21.34,53.34 20.57,54.1 20.57,59.44 17.27,62.74 17.27,66.55 | D4.2 41.21,54.04 41.02,54.23 | D5.2 38.65,47.07 38.48,47.24
  Top 0.813: U2.8 30.86,71.5 30.48,71.88 24.13,71.88 22.52,70.27 22.52,69.85 22.52,67.82 | 22.52,67.82 19.05,67.82 17.78,66.55 17.27,66.55 v15.24,66.55 | 22.52,67.82 24.64,65.79 27.43,65.79 27.94,66.29 U1.P$3 | v3.56,72.39 3.56,71.12 3.56,68.07 5.08,66.55 | 5.08,66.55 v9.91,66.55 | 5.08,66.55 2.79,64.26 v2.79,57.15 | C16.2 45.55,29.04 46.48,29.97 46.48,39.62 44.2,41.91 43.43,41.91 42.42,42.93 39.12,42.93 38.48,43.56 38.48,47.24 38.48,51.69 41.02,54.23 41.31,54.52 C9.1 41.31,58.68 C2.+
  Top 1.016: U1.P$3 40.39,59.44 C2.+
  Bottom 0.406: v5.21,51.82 6.99,51.82 8.26,50.42 v8.26,49.4
  Bottom 0.813: J2.P$2 3.56,76.2 v3.56,72.39 | v9.91,66.55 v15.24,66.55 | v2.79,57.15 2.79,55.12 J3.P$8
AN_VOLT_IN  (via drill 0.6)
  Top 0.406: v32.13,51.18 33.4,51.18 v34.04,50.55 | v39.75,50.55 39.75,50.04 41.15,48.64 42.29,48.64 | 42.29,48.64 R14.1 | R14.1 R12.2 | R14.1 44.15,48.72 | D4.3 42.16,48.77 42.29,48.64 | U3.24 21.46,49.55 v21.46,48.01
  Bottom 0.406: v34.04,50.55 v39.75,50.55 | v21.46,48.01 21.59,48.13 27.05,48.13 28.45,46.74 30.23,46.74 32.13,48.64 v32.13,51.18
AN_VOLT_OUT  (via drill 0.6)
  Top 0.406: v30.1,48.26 31.37,48.26 v33.91,45.72 | v39.75,44.7 41.15,44.7 | 41.15,44.7 44.11,44.7 R13.2 R15.1 | D5.3 41.32,44.87 41.15,44.7 | v20.7,52.07 20.45,52.07 19.75,51.37 U3.22
  Bottom 0.406: v20.7,52.07 22.61,50.29 28.07,50.29 v30.1,48.26 | v33.91,45.72 34.92,44.7 v39.75,44.7
BUT  (via drill 0.6)
  Top 0.406: v23.37,53.59 22.61,53.59 22.1,54.1 22.1,58.67 23.11,59.69 23.11,61.1 U3.8 23.04,63.43 D2.2 | R7.1 12.28,48.39 C11.2 13.5,48.68 13.84,49.02 13.84,50.04 14.35,50.55 v15.49,50.55
  Bottom 0.406: v15.49,50.55 16.89,50.55 19.94,53.59 v23.37,53.59
BUT1  (via drill 0.6)
  Top 0.406: R6.1 21.34,71.37 v20.32,72.39 20.32,71.97 R8.2
  Bottom 0.406: S1.2 S1.1 18.36,72.39 v20.32,72.39
BUT2  (via drill 0.6)
  Top 0.406: R8.1 C10.2 17.78,68.33 arc90 v17.78,68.07 | U3.9 22.24,62.33 D2.1 19.81,64.75 v19.81,66.04
  Bottom 0.406: v19.81,66.04 v17.78,68.07
BUT_TOP
  Top 0.406: R5.1 9.78,48.51 10.58,47.62 R7.2 10.33,46.74 J3.P$2
CLK
  Top 0.406: U3.39 32.26,55.37 36.32,51.31 36.32,42.42 38.35,40.39 41.4,40.39 42.42,39.37 43.43,39.37 43.94,38.86 43.94,36.07 43.78,35.91 U5.16 40.74,35.91 38.35,33.53 R32.2
DBG  (via drill 0.6)
  Top 0.406: U3.4 26.24,58.5 25.65,57.91 24.38,57.91 v23.62,58.67 | v17.02,58.93 14.99,60.96 14.99,64.01 13.72,65.28 13.72,71.88 v14.22,72.39
  Bottom 0.406: J2.P$6 9.14,83.31 12.32,80.14 12.32,74.3 v14.22,72.39 | v23.62,58.67 17.27,58.67 v17.02,58.93
DI
  Top 0.406: U3.38 32.17,54.57 35.69,51.05 35.69,42.04 41.16,36.56 U5.17 40.37,36.56 36.83,33.02 R30.2
DO
  Top 0.406: U3.41 32.44,56.97 37.59,51.82 37.59,43.18 38.86,41.91 41.91,41.91 42.93,40.89 43.94,40.89 45.47,39.37 45.47,35.56 44.52,34.61 U5.14 41.47,34.61 41.15,34.29 41.15,31.24 R31.2
LD
  Top 0.406: U3.40 32.35,56.17 36.96,51.56 36.96,42.8 38.61,41.15 41.66,41.15 42.67,40.13 43.69,40.13 44.7,39.12 44.7,35.81 44.15,35.26 U5.15 41.1,35.26 39.88,34.04 R33.2
MCLR#1  (via drill 0.6)
  Top 0.406: U3.18 15.28,54.57 12.7,57.15 12.7,62.99 11.43,64.26 11.43,71.37 10.41,72.39 v9.4,72.39 R10.1
  Bottom 0.406: v9.4,72.39 9.4,76.45 J2.P$1
N$1  (via drill 0.6)
  Top 0.813: R4.2 24.66,70.13 v24.38,70.36
  Bottom 0.813: v24.38,70.36 24.38,77.98 JP1.1
N$2
  Top 0.406: R16.1 6.86,36.58 8.14,37.86 U5.2
N$6
  Top 0.406: U4.3 9.53,21.72 9.78,21.97 9.78,25.53 8.89,26.42 6.35,26.42 5.84,26.92 5.84,28.96 6.24,29.35 C14.2 R16.2
N$7
  Top 0.406: U5.5 18.29,35.91 17.79,35.91 16.35,35.91 14.73,34.29 R28.1
N$8
  Top 0.406: R24.1 12.19,35.05 13.7,36.56 U5.4
N$9
  Top 0.406: D3.2 6.35,69 arc90 R9.1 R10.2 C12.2
N$11
  Top 0.406: U6.2 24.73,22.99 R39.1 23.84,22.52 23.75,22.61 23.42,22.95 R38.1
N$12
  Top 0.406: R43.1 24.47,18.34 R42.1 25.23,17.91 U6.6
N$13
  Top 0.406: R47.1 35.65,16.97 R46.1 33.19,17.91 U6.9
N$14
  Top 0.406: U6.13 33.57,22.99 R51.1 34.62,21.93 R50.1
N$15
  Top 0.61: R37.1 20.32,21.72 21.59,22.99 21.59,23.75 22.1,24.26 24.34,24.26 R39.2 24.42,24.26 U6.1
N$16
  Top 0.406: U6.7 R43.2 22.82,14.99 R41.1
N$17
  Top 0.406: U6.8 R47.2
  Top 0.61: U6.8 31.2,16.64 R45.1
N$18
  Top 0.406: R51.2 31.85,24.22 U6.14
  Top 0.61: R49.1 36.32,14.99 36.96,15.62 36.96,22.86 35.6,24.22 R51.2
N$19
  Top 0.406: R36.1 25.4,34.29 26.37,35.26 U5.6
N$20
  Top 0.406: U4.2 6.44,22.99 R19.1 5.93,22.48 5.33,22.48 4.74,23.07 R18.1
N$21
  Top 0.406: R23.1 4.36,16.59 R22.1 6.82,17.91 U4.6
N$22
  Top 0.406: U4.9 14.77,17.91 R26.1 15.53,18.34 R27.1
N$23
  Top 0.406: U4.13 15.15,22.99 R35.1 16.21,21.93 R34.1
N$24
  Top 0.406: U4.1 6.01,24.26 R19.2
  Top 0.61: R19.2 5.93,24.26 3.43,24.26 1.78,22.61 1.78,16.38 3.17,14.99 R17.1
N$25
  Top 0.406: 7.66,16.64 R23.2
  Top 0.61: 7.66,16.64 U4.7 9.06,16.64 R21.1
N$26
  Top 0.406: U4.8 R27.2 17.18,14.99
  Top 0.61: R27.2 15.49,16.6 | R25.1 17.18,14.99
N$27
  Top 0.406: R35.2 U4.14
  Top 0.61: R35.2 15.66,24.26 16.76,24.26 18.8,22.23 R29.1
N$28
  Top 0.406: R40.1 27.94,33.78 28.77,34.61 U5.7
N$29
  Top 0.406: U5.9 33.73,33.31 R48.1
N$30
  Top 0.406: U4.5 9.53,19.18 10.41,20.07 10.41,28.96 10.07,29.3 C15.2 R20.2
N$31
  Top 0.406: R20.1 9.4,35.56 11.05,37.21 U5.3
N$32
  Top 0.406: Q1.2 24.04,42.84 C7.2 24.04,46.65 24.64,47.24 25.27,47.24 26.24,48.21 U3.30
N$33
  Top 0.406: C8.+ 19.25,48.26 20.32,48.26 20.64,48.58 U3.23
N$34
  Top 0.406: R44.1 30.73,33.53 31.17,33.96 U5.8
N$35
  Top 0.406: U4.10 11.81,19.18 11.18,19.81 11.18,28.96 11.52,29.3 C17.2 R24.2
N$36
  Top 0.406: U4.12 12.06,21.72 11.81,21.97 11.81,25.53 12.7,26.42 15.24,26.42 15.75,26.92 15.75,29.21 15.41,29.55 C19.2 R28.2
N$37
  Top 0.406: U6.3 27.94,21.72 28.19,21.97 28.19,25.27 27.05,26.42 24.89,26.42 24.38,26.92 24.38,28.96 24.98,29.55 C21.2 R36.2
N$38
  Top 0.406: R40.2 C22.2 28.49,29.55 28.83,29.21 28.83,20.19 27.81,19.18 U6.5
N$39
  Top 0.406: R44.2 C23.2 30.06,29.55 29.59,29.08 29.59,20.19 30.61,19.18 U6.10
N$40
  Top 0.406: U6.12 30.35,21.72 30.23,21.84 30.23,25.4 31.24,26.42 33.78,26.42 34.29,26.92 34.29,29.21 33.95,29.55 C24.2 R48.2
OUT1  (via drill 0.6)
  Top 0.406: v7.37,14.99 R17.2
  Bottom 0.406: J4.P$11 9,13.35 v7.37,14.99
  Bottom 0.813: J4.P$23 J4.P$11
OUT2  (via drill 0.6)
  Top 0.406: v11.94,14.99 R21.2
  Bottom 0.406: J4.P$10 12.5,14.42 v11.94,14.99
  Bottom 0.813: J4.P$22 J4.P$10
OUT3  (via drill 0.6)
  Top 0.406: v14.22,14.99 R25.2
  Bottom 0.406: J4.P$9 16,13.21 v14.22,14.99
  Bottom 0.813: J4.P$21 J4.P$9
OUT4  (via drill 0.6)
  Top 0.406: v18.8,14.99 R29.2
  Bottom 0.406: J4.P$8 19.5,14.28 v18.8,14.99
  Bottom 0.813: J4.P$20 J4.P$8
OUT5  (via drill 0.6)
  Top 0.406: v20.32,14.99 R37.2
  Bottom 0.406: J4.P$7 23,12.31 v20.32,14.99
  Bottom 0.813: J4.P$19 J4.P$7
OUT6  (via drill 0.6)
  Top 0.406: v25.91,14.99 R41.2
  Bottom 0.406: J4.P$6 26.5,14.39 v25.91,14.99
  Bottom 0.813: J4.P$18 J4.P$6
OUT7  (via drill 0.6)
  Top 0.406: v27.94,14.99 R45.2
  Bottom 0.406: J4.P$5 30,12.93 v27.94,14.99
  Bottom 0.813: J4.P$17 J4.P$5
OUT8  (via drill 0.6)
  Top 0.406: v32.51,14.99 R49.2
  Bottom 0.406: J4.P$4 33.5,14 v32.51,14.99
  Bottom 0.813: J4.P$16 J4.P$4
PGC#1  (via drill 0.6)
  Top 0.406: U3.16 15.71,56.17 14.22,57.66 14.22,63.5 12.95,64.77 v12.95,72.39
  Bottom 0.406: J2.P$5 11.56,79.38 11.56,73.79 v12.95,72.39
PGD#1  (via drill 0.6)
  Top 0.406: U3.17 15.49,55.37 13.46,57.4 13.46,63.25 12.19,64.52 12.19,71.88 v11.68,72.39
  Bottom 0.406: J2.P$4 9.14,80.77 10.79,79.12 10.79,73.28 v11.68,72.39
RS485_A  (via drill 0.6)
  Top 0.813: U2.6 33.4,72.26 v33.27,72.39
  Bottom 0.813: v33.27,72.39 29.72,75.95 J1.P$1 28.7,77.22 24.38,81.53 JP1.2
RS485_B  (via drill 0.6)
  Top 0.813: U2.7 32.13,68.2 v32.26,68.07 31.47,67.28 R4.1
  Bottom 0.813: v32.26,68.07 32.26,69.09 35.81,72.64 35.81,76.12 J1.P$2
RS485_DIR
  Top 0.406: U3.2 27.84,60.05 28.19,59.69 28.96,59.69 29.72,60.45 31.24,60.45 31.92,61.13 R3.2 arc90 32.13,61.94 U2.2 U2.3
RS485_RX
  Top 0.406: U3.1 29.68,61.17 30.86,62.36 U2.1
RS485_TX
  Top 0.406: U3.44 33.72,59.37 34.67,60.33 U2.4
SCL  (via drill 0.6)
  Top 0.406: U3.37 24.56,53.77 v23.37,54.86 | J3.P$4 6.6,49.28 9.14,51.82 v12.95,51.82 16.26,51.82 v16.51,51.56 | R2.2 11.98,54.1 v12.95,54.1
  Bottom 0.406: v23.37,54.86 19.81,54.86 v16.51,51.56 | v12.95,51.82 v12.95,54.1
SDA  (via drill 0.6)
  Top 0.406: v23.37,56.13 27.43,56.13 29.07,57.77 U3.42 | 9.78,52.83 8.38,52.83 J3.P$5 | 9.78,52.83 v16.51,52.83 | R1.2 9.65,52.96 9.78,52.83
  Bottom 0.406: v16.51,52.83 19.81,56.13 v23.37,56.13
STAT1
  Top 0.406: U3.27 23.84,48.09 21.72,45.97 17.65,45.97 12.83,41.15 2.54,41.15 1.52,42.16 1.52,54.61 2.54,55.63 4.06,55.63 6.1,53.59 J3.P$7
STAT2
  Top 0.406: U3.26 23.04,48.18 21.59,46.74 17.27,46.74 12.45,41.91 2.79,41.91 2.29,42.42 2.29,50.55 J3.P$6
Y1
  Top 0.406: U3.31 27.04,48.4 29.04,46.39 C5.2 29.04,43.09 29.21,42.67 Q1.1